# EAGLE schematic WRC (EAGLE 7.2.0)
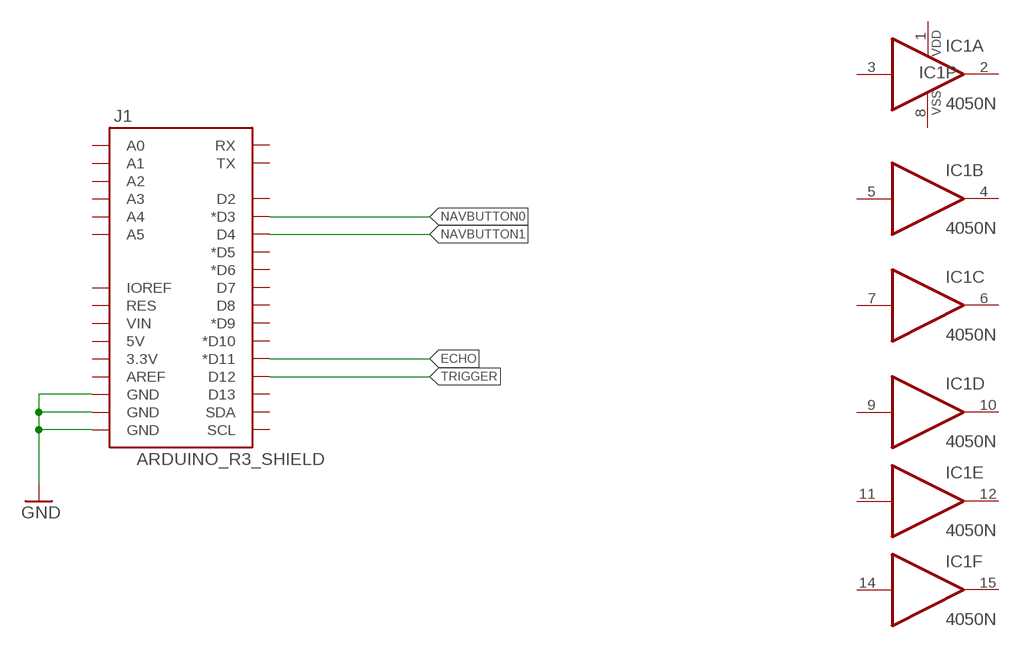
[diagram p0: schematic, sheet 1]

## Parts
IC1  4050N  [DIL16]
J1  ARDUINO_R3_SHIELD  [UNO_R3_SHIELD]

## Nets
ECHO: J1.D11(*D11)
GND: J1.GND@0(GND) J1.GND@1(GND) J1.GND@2(GND)
NAVBUTTON0: J1.D3(*D3)
NAVBUTTON1: J1.D4
TRIGGER: J1.D12
Unconnected: IC1.2(A:O) IC1.3(A:I) IC1.4(B:O) IC1.5(B:I) IC1.6(C:O) IC1.7(C:I) IC1.9(D:I) IC1.10(D:O) IC1.11(E:I) IC1.12(E:O) IC1.14(F:I) IC1.15(F:O) J1.3.3V J1.5V J1.A0 J1.A1 J1.A2 J1.A3 J1.A4 J1.A5 J1.AREF J1.D2 J1.D5(*D5) J1.D6(*D6) J1.D7 J1.D8 J1.D9(*D9) J1.D10(*D10) J1.D13 J1.IOREF J1.RES J1.RX J1.SCL J1.SDA J1.TX J1.VIN

## Power pins joined to a net without a drawn wire
VDD: IC1.1(P:VDD)
VSS: IC1.8(P:VSS)

## Library data of the parts
IC1 = 40xx:4050: Hex non-inverting BUFFER
J1 = SparkFun-Boards:ARDUINO_R3_SHIELD: Shield form compatible with the Arduino Uno R3.